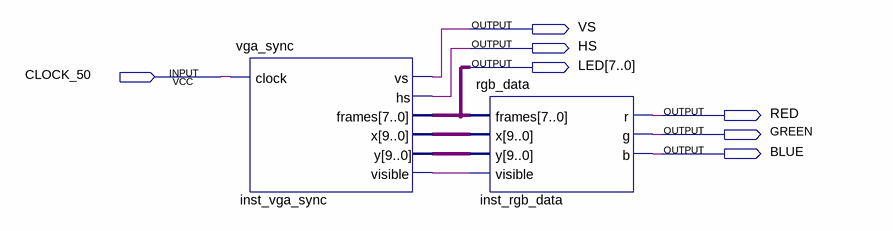
[diagram p0: schematic sheet]
// Quartus schematic VGA.bdf as structural Verilog: 2 symbols, 7 pins
module VGA (
  input  CLOCK_50,
  output VS,
  output HS,
  output [7:0] LED,
  output RED,
  output GREEN,
  output BLUE
);

  wire inst_vga_sync_visible;
  wire [9:0] inst_vga_sync_x, inst_vga_sync_y;

  vga_sync inst_vga_sync (
    .clock(CLOCK_50), .vs(VS), .hs(HS), .frames(LED), .x(inst_vga_sync_x), .y(inst_vga_sync_y),
    .visible(inst_vga_sync_visible));
  rgb_data inst_rgb_data (
    .frames(LED), .x(inst_vga_sync_x), .y(inst_vga_sync_y), .visible(inst_vga_sync_visible), .r(RED),
    .g(GREEN), .b(BLUE));
endmodule
